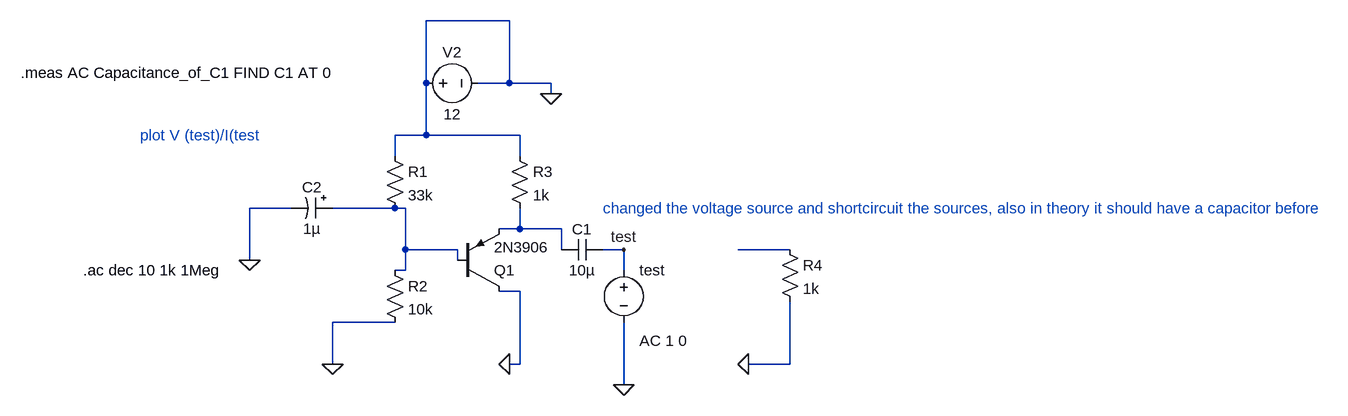
[diagram p0: schematic output_impedance_test.asc]
output_impedance_test.asc, the LTspice schematic file:
Version 4
SHEET 1 1788 680
WIRE 432 -160 304 -160
WIRE 304 -64 304 -160
WIRE 432 -64 432 -160
WIRE 432 -64 384 -64
WIRE 496 -64 432 -64
WIRE 496 -48 496 -64
WIRE 304 16 304 -64
WIRE 304 16 256 16
WIRE 448 16 304 16
WIRE 256 48 256 16
WIRE 448 48 448 16
WIRE 96 128 32 128
WIRE 256 128 160 128
WIRE 272 128 256 128
WIRE 448 160 448 128
WIRE 448 160 416 160
WIRE 512 160 448 160
WIRE 272 192 272 128
WIRE 352 192 272 192
WIRE 512 192 512 160
WIRE 608 192 576 192
WIRE 864 192 784 192
WIRE 32 208 32 128
WIRE 352 208 352 192
WIRE 272 224 272 192
WIRE 272 224 256 224
WIRE 608 224 608 192
WIRE 448 256 416 256
WIRE 256 304 160 304
WIRE 160 368 160 304
WIRE 448 368 448 256
WIRE 448 368 432 368
WIRE 864 368 864 272
WIRE 864 368 800 368
WIRE 608 400 608 304
FLAG 608 400 0
FLAG 160 368 0
FLAG 496 -48 0
FLAG 432 368 0
FLAG 800 368 0
FLAG 608 192 test
FLAG 32 208 0
SYMBOL voltage 608 208 R0
WINDOW 123 24 124 Left 2
WINDOW 39 0 0 Left 0
SYMATTR InstName test
SYMATTR Value ""
SYMATTR Value2 AC 1 0
SYMBOL voltage 288 -64 R270
WINDOW 0 32 56 VTop 2
WINDOW 3 -32 56 VBottom 2
SYMATTR InstName V2
SYMATTR Value 12
SYMBOL res 240 32 R0
SYMATTR InstName R1
SYMATTR Value 33k
SYMBOL res 240 208 R0
SYMATTR InstName R2
SYMATTR Value 10k
SYMBOL res 432 32 R0
SYMATTR InstName R3
SYMATTR Value 1k
SYMBOL res 848 176 R0
SYMATTR InstName R4
SYMATTR Value 1k
SYMBOL cap 576 176 R90
WINDOW 0 0 32 VBottom 2
WINDOW 3 32 32 VTop 2
SYMATTR InstName C1
SYMATTR Value 10µ
SYMBOL polcap 160 112 R90
WINDOW 0 0 32 VBottom 2
WINDOW 3 32 32 VTop 2
SYMATTR InstName C2
SYMATTR Value 1µ
SYMBOL pnp 352 256 M180
SYMATTR InstName Q1
SYMATTR Value 2N3906
TEXT -224 224 Left 2 !.ac dec 10 1k 1Meg
TEXT -136 16 Left 2 ;plot V (test)/I(test
TEXT -320 -80 Left 2 !.meas AC Capacitance_of_C1 FIND C1 AT 0
TEXT 576 128 Left 2 ;changed the voltage source and shortcircuit the sources, also in theory it should have a capacitor before

The netlist it stands for:
* output_impedance_test.asc
V§test test 0 AC 1 0
V2 0 0 12
R1 0 N001 33k
R2 N001 0 10k
R3 0 N002 1k
R4 N003 0 1k
C1 test N002 10µ
C2 N001 0 1µ
Q1 0 N001 N002 0 2N3906
.model NPN NPN
.model PNP PNP
.lib standard.bjt
.ac dec 10 1k 1Meg
* plot V (test)/I(test
.meas AC Capacitance_of_C1 FIND C1 AT 0
* changed the voltage source and shortcircuit the sources, also in theory it should have a capacitor before
.backanno
.end